# EAGLE design NeopixelStickOnAStick (EAGLE 7.4.0)
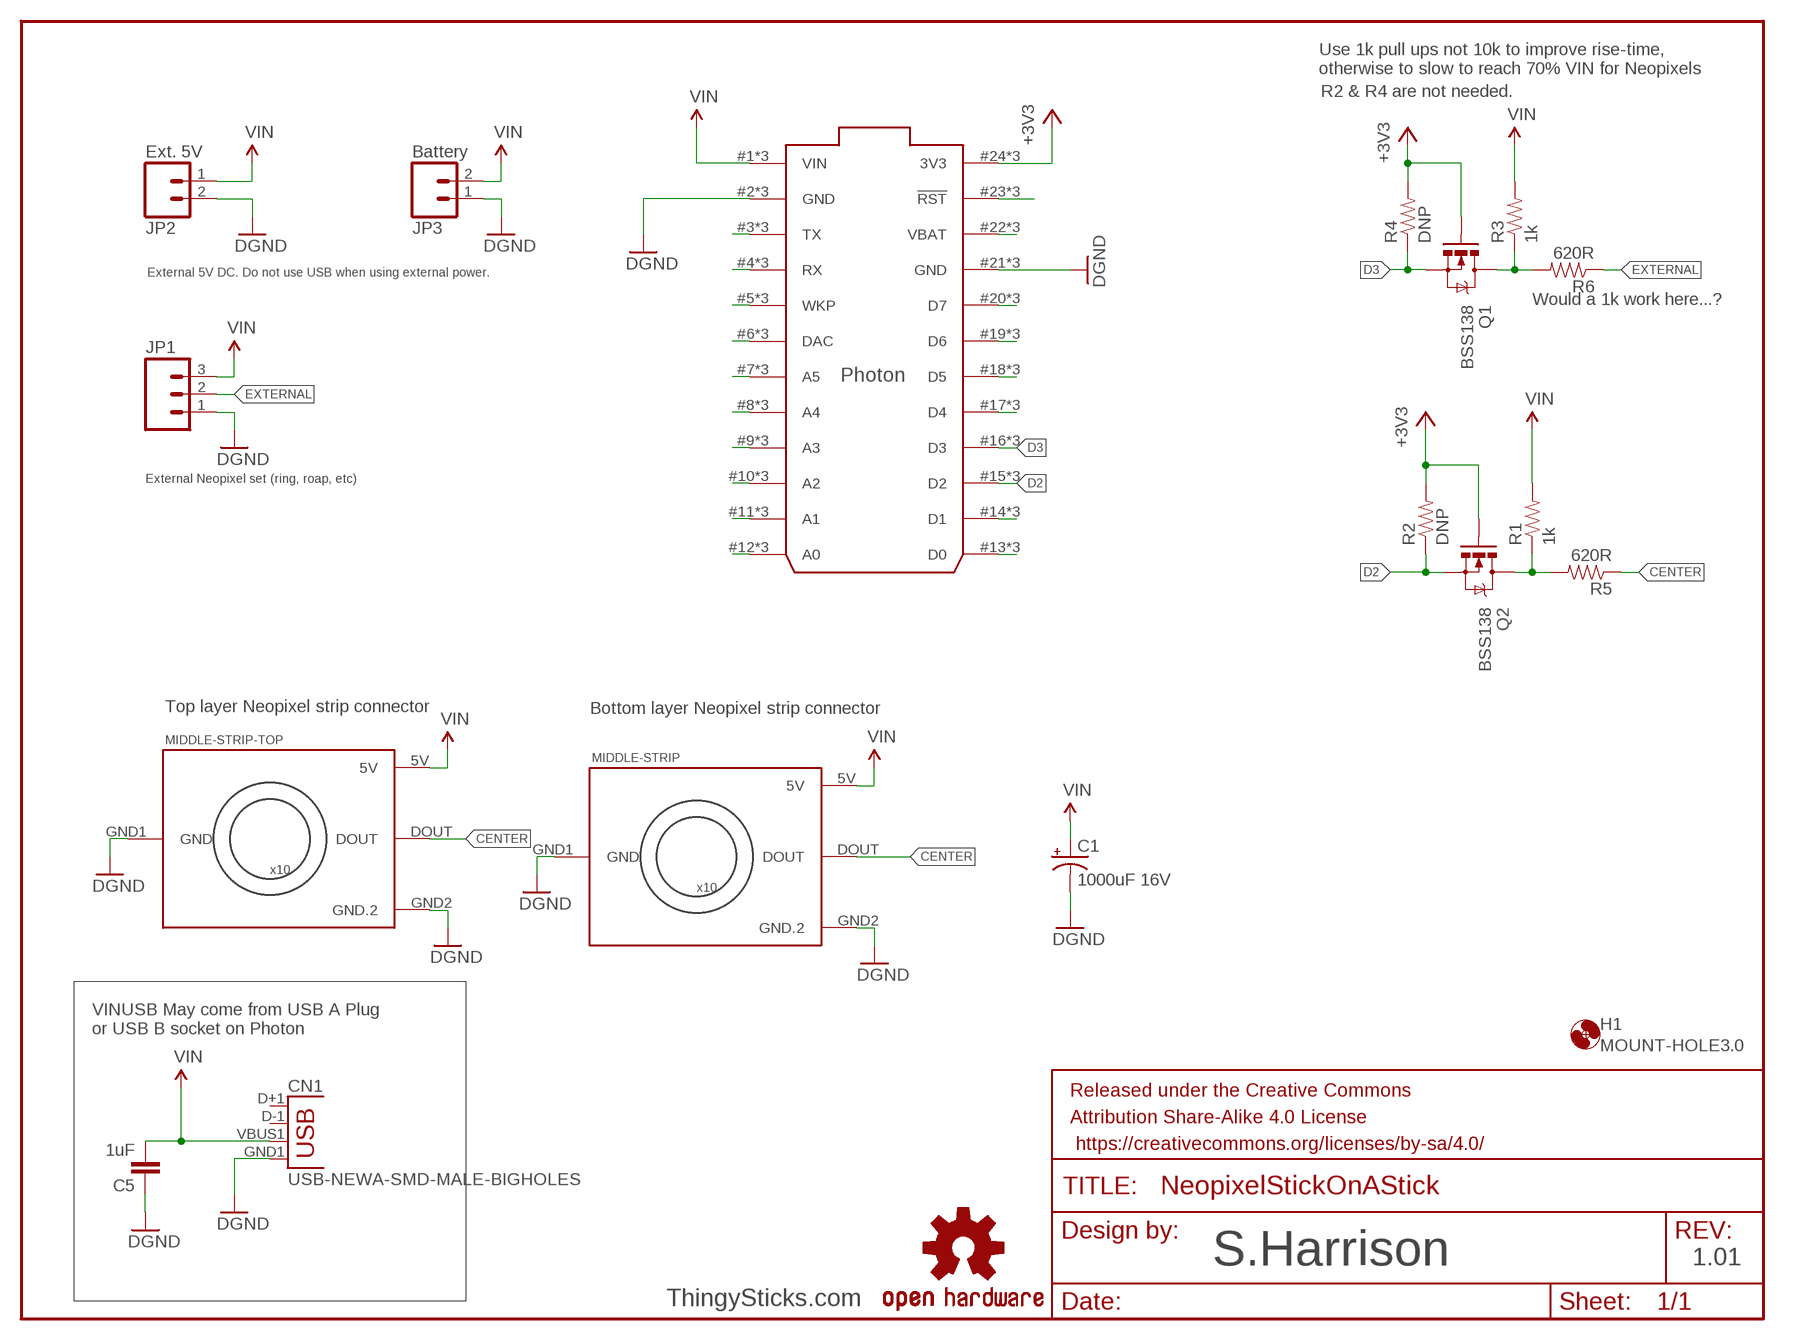
[diagram p0: schematic, sheet 1]

## Parts
C1  1000uF 16V  1000UF-25V(PTH)  [CPOL-RADIAL-1000UF-25V]
C5  1uF  CAP0805  [0805]
CN1  USB-NEWA-SMD-MALE-BIGHOLES  [USB-A-SMT-MALE]
FRAME2  FRAME-LETTER  [CREATIVE_COMMONS]
H1  MOUNT-HOLE3.0  [3,0]
JP1  M03POLAR  [MOLEX-1X3]
JP2  Ext. 5V  M023.5MM  [SCREWTERMINAL-3.5MM-2]
JP3  Battery  M02-JST-2MM-SMT  [JST-2-SMD]
LOGO2  OSHW-LOGOM  [OSHW-LOGO-M]
MIDDLE-STRIP  NEOPIXEL-STRIPBOTTOM'  [NEOPIXEL-STRIP]
MIDDLE-STRIP-TOP  NEOPIXEL-STRIPBOTTOM'  [NEOPIXEL-STRIP]
Q1  BSS138  MOSFET-NCHANNELBSS138  [SOT23-3]
Q2  BSS138  MOSFET-NCHANNELBSS138  [SOT23-3]
R1  1k  RESISTOR1206  [1206]
R2  DNP  RESISTOR1206  [1206]
R3  1k  RESISTOR1206  [1206]
R4  DNP  RESISTOR1206  [1206]
R5  620R  RESISTOR1206  [1206]
R6  620R  RESISTOR1206  [1206]
U$1  PHOTON_WITH_STACKABLE_HEADERS  [PHOTON_STACKABLE]

## Nets
+3V3: Q1.1(G) Q2.1(G) R2.2 R4.2 U$1.24(3V3) U$1.#24(3V3) U$1.@24(3V3)
CENTER: MIDDLE-STRIP-TOP.DOUT MIDDLE-STRIP.DOUT R5.1
D2: Q2.2(S) R2.1 U$1.15(D2) U$1.#15(D2) U$1.@15(D2)
D3: Q1.2(S) R4.1 U$1.16(D3) U$1.#16(D3) U$1.@16(D3)
EXTERNAL: JP1.2 R6.1
GND: C1.- C5.1 CN1.GND1(GND) JP1.1 JP2.2 JP3.1 MIDDLE-STRIP-TOP.GND1(GND) MIDDLE-STRIP-TOP.GND2(GND.2) MIDDLE-STRIP.GND1(GND) MIDDLE-STRIP.GND2(GND.2) U$1.2(GND) U$1.21(GND) U$1.#2(GND) U$1.#21(GND) U$1.@2(GND) U$1.@21(GND) ; supply symbol labelled DGND
N$1: U$1.13(D0) U$1.#13(D0) U$1.@13(D0)
N$3: U$1.14(D1) U$1.#14(D1) U$1.@14(D1)
N$4: Q1.3(D) R3.1 R6.2
N$5: Q2.3(D) R1.1 R5.2
N$6: U$1.17(D4) U$1.#17(D4) U$1.@17(D4)
N$7: U$1.18(D5) U$1.#18(D5) U$1.@18(D5)
N$11: U$1.19(D6) U$1.#19(D6) U$1.@19(D6)
N$12: U$1.20(D7) U$1.#20(D7) U$1.@20(D7)
N$13: U$1.22(VBAT) U$1.#22(VBAT) U$1.@22(VBAT)
N$14: U$1.23(!RST) U$1.#23(!RST) U$1.@23(!RST)
N$16: U$1.3(TX) U$1.#3(TX) U$1.@3(TX)
N$18: U$1.4(RX) U$1.#4(RX) U$1.@4(RX)
N$19: U$1.5(WKP) U$1.#5(WKP) U$1.@5(WKP)
N$20: U$1.6(DAC) U$1.#6(DAC) U$1.@6(DAC)
N$21: U$1.7(A5) U$1.#7(A5) U$1.@7(A5)
N$22: U$1.8(A4) U$1.#8(A4) U$1.@8(A4)
N$23: U$1.9(A3) U$1.#9(A3) U$1.@9(A3)
N$24: U$1.10(A2) U$1.#10(A2) U$1.@10(A2)
N$25: U$1.11(A1) U$1.#11(A1) U$1.@11(A1)
N$26: U$1.12(A0) U$1.#12(A0) U$1.@12(A0)
VIN: C1.+ C5.2 CN1.VBUS1(VBUS) JP1.3 JP2.1 JP3.2 MIDDLE-STRIP-TOP.5V MIDDLE-STRIP.5V R1.2 R3.2 U$1.1(VIN) U$1.#1(VIN) U$1.@1(VIN)
Unconnected: CN1.D+1(D+) CN1.D-1(D-)

## Notes on the sheet
- Use 1k pull ups not 10k to improve rise-time, 
  otherwise to slow to reach 70% VIN for Neopixels
- R2 & R4 are not needed.
- External 5V DC. Do not use USB when using external power.
- Would a 1k work here...?
- External Neopixel set (ring, roap, etc)
- Top layer Neopixel strip connector | Bottom layer Neopixel strip connector
- VINUSB May come from USB A Plug 
  or USB B socket on Photon
- S.Harrison | 1.01
- ThingySticks.com

## Library data of the parts
C1 = SparkFun-Capacitors:1000UF-25V(PTH): CAP-08070; PROD_ID: CAP-09538; VALUE: CAP-09538
C5 = SparkFun-Passives:CAP: Capacitor Standard 0603 ceramic capacitor, and 0.1" leaded capacitor.
CN1 = Tinamous:USB-NEW: USB Connectors USB-B-PTH is fully proven SKU : PRT-00139/CONN-08278 USB-miniB is fully proven SKU : PRT-00587 USB-A-PCB is untested. USB-A-H is throughly reviewed, but untested. Spark Fun Electronics SKU : PRT-00437 USB-B-SMT is throughly reviewed, but untested. Needs silkscreen touching up. USB-A-S has not been used/tested USB-MB-H has not been used/tested USB-MICROB has been used. CONN-09505
FRAME2 = SparkFun-Aesthetics:FRAME-LETTER: Schematic Frame Standard 8.5x11 US Letter frame
H1 = holes:MOUNT-HOLE: MOUNTING HOLE with drill center marker
JP1 = SparkFun-Connectors:M03: Header 3 Standard 3-pin 0.1" header. Use with straight break away headers (SKU : PRT-00116), right angle break away headers (PRT-00553), swiss pins (PRT-00743), machine pins (PRT-00117), and female headers (PRT-00115). Molex polarized connector foot print use with SKU : PRT-08232 with associated crimp pins and housings.
JP2 = SparkFun-Connectors:M02: Standard 2-pin 0.1" header. Use with - straight break away headers ( PRT-00116) - right angle break away headers (PRT-00553) - swiss pins (PRT-00743) - machine pins (PRT-00117) - female headers (PRT-00115) Molex polarized connector foot print use with: PRT-08233 with associated crimp pins and housings. 2.54_SCREWTERM for use with PRT-10571. 3.5mm Screw Terminal footprints for PRT-08084 5mm Screw Terminal footprints for use with PRT-08432; PROD_ID: CONN-08399
JP3 = SparkFun-Connectors:M02: Standard 2-pin 0.1" header. Use with - straight break away headers ( PRT-00116) - right angle break away headers (PRT-00553) - swiss pins (PRT-00743) - machine pins (PRT-00117) - female headers (PRT-00115) Molex polarized connector foot print use with: PRT-08233 with associated crimp pins and housings. 2.54_SCREWTERM for use with PRT-10571. 3.5mm Screw Terminal footprints for PRT-08084 5mm Screw Terminal footprints for use with PRT-08432; PROD_ID: CONN-11443
LOGO2 = SparkFun-Aesthetics:OSHW-LOGO: Open Source Hardware Logo This logo indicates the piece of hardware it is found on incorporates a OSHW license and/or adheres to the definition of open source hardware found here: http://freedomdefined.org/OSHW
MIDDLE-STRIP MIDDLE-STRIP-TOP = Tinamous:NEOPIXEL-STRIP
Q1 Q2 = SparkFun-DiscreteSemi:MOSFET-NCHANNEL: Common NMOSFET Parts MFG P/N Store ID Prod ID FDD8780 TRANS-09984 SI7820DN TRANS-11055 FDS6630A IC-08089 2N7002PW TRANS-11151 FQP30N06L COM-10213 TRANS-10060 BSS123LT1G TRANS-08345 BSS138 TRANS-00830 BS170 2N7000; PROD_ID: TRANS-00830; VALUE: 200mA/50V
R1-R6 = SparkFun-Resistors:RESISTOR: Resistor Basic schematic elements and footprints for 0603, 1206, and PTH resistors.
U$1 = Tinamous:PHOTON

## Board
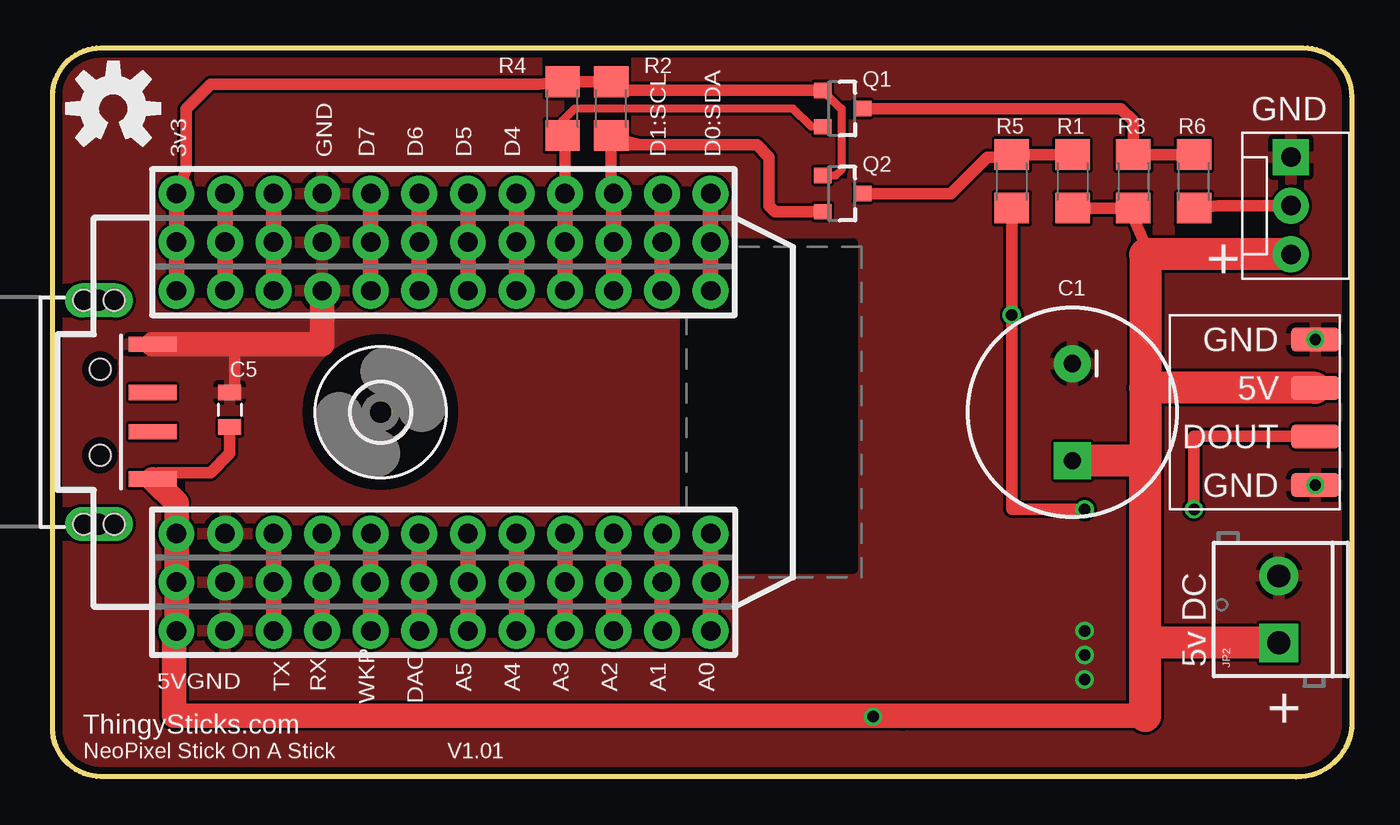
[diagram p1: board, top side]
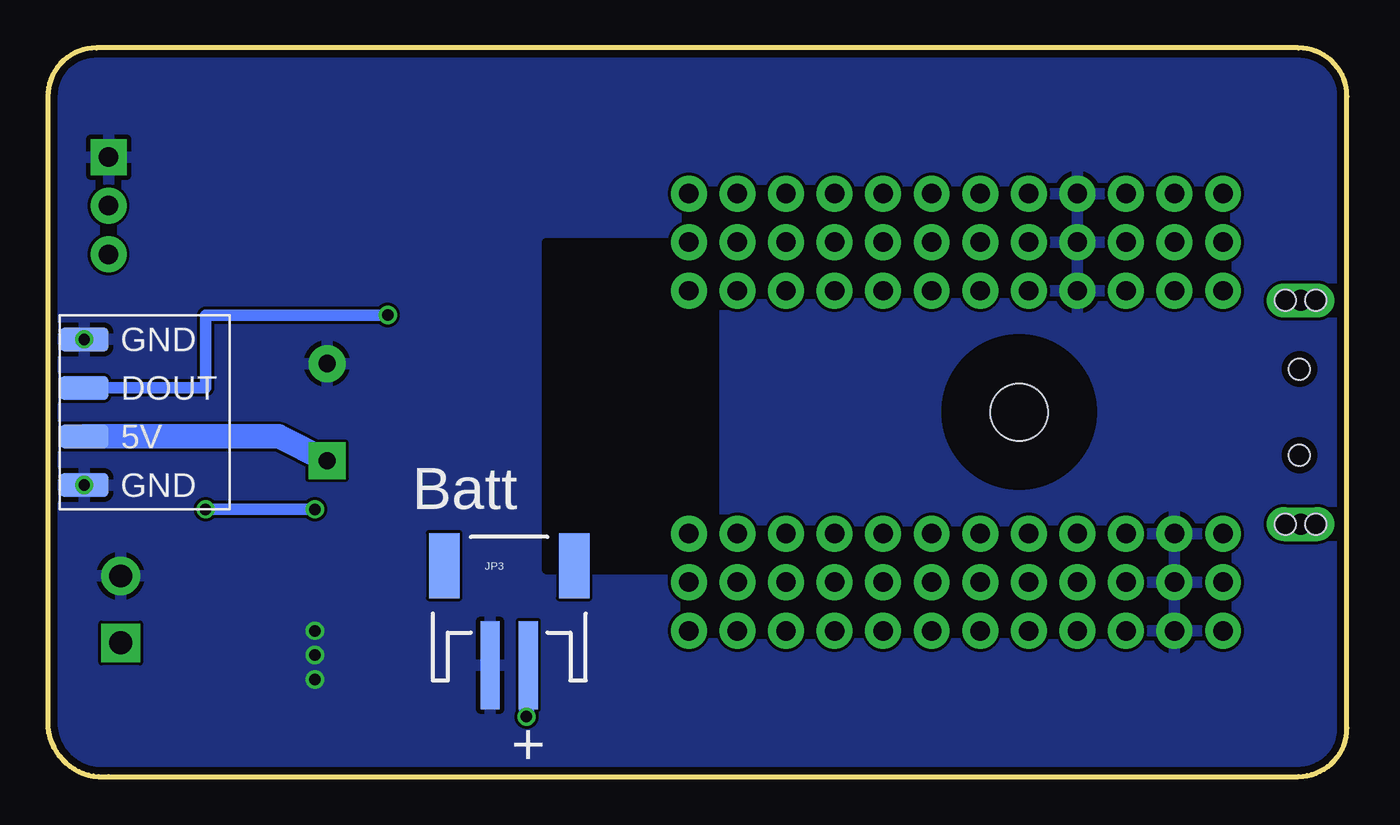
[diagram p2: board, bottom side, seen from below]

Size 67.94 x 38.12 mm. Coordinates in mm from the lower left corner, seen from the top.
Outline: 0,2.56 0,35.58 arc-90 2.54,38.12 65.41,38.12 arc-90 67.94,35.58 67.94,2.56 arc-90 64.77,0.02 2.54,0.02 arc-90 0,2.56
Copper layers (1*16): Top 0.0356mm / dielectric 1.5011mm / Bottom 0.0356mm
Design rules "OSHPark": minimum track width 6mil, minimum drill 13mil, track to track 6mil, track to pad 6mil, pad to pad 6mil, via to via 6mil, smd to smd 6mil, copper to edge 15mil, drill to drill 6mil, minimum pad ring 7mil, minimum via ring 7mil, stop-mask expansion 3mil, vias tented up to drill 0mil, thermal gap 10mil
tRestrict: area 33,10.8 to 41.9,28
bRestrict: area 33,10.8 to 41.9,28

### Footprints (pad centres in the part's own frame; a part is rotated, then mirrored left to right if it is on the bottom)
CPOL-RADIAL-1000UF-25V = drill 0.9 pad 1.93 square: + 2.54,0 | drill 0.9 pad 1.93: - -2.54,0
0805 = smd 0.8 x 1.2: 1 -0.9,0; 2 0.9,0
USB-A-SMT-MALE = smd 0.8 x 2.5: D+1 1.027,-5.87; D-1 -1.027,-5.87; GND1 3.551,-5.87; VBUS1 -3.5,-5.87 | drill 1.1 pad 1.778 long: P$1 5.85,-3.05; P$3 -5.85,-3.05 | hole 1.1: 2.25,-3.12; -2.25,-3.12; -5.85,-3.85; -5.85,-2.25; 5.85,-3.85; 5.85,-2.25
3,0 = hole 3: 0,0
MOLEX-1X3 = drill 1.016 pad 1.88 square: 1 0,0 | drill 1.016 pad 1.88: 2 2.54,0; 3 5.08,0
SCREWTERMINAL-3.5MM-2 = drill 1.2 pad 2.032 square: 1 0,0 | drill 1.2 pad 2.032: 2 3.5,0
JST-2-SMD = smd 1 x 4.6: 1 -1,-3.7; 2 1,-3.7 | smd 1.6 x 3.4: NC1 -3.4,1.5; NC2 3.4,1.5
NEOPIXEL-STRIP = smd 1.27 x 2.54 bottom: 5V 6.35,-1.27; DOUT 3.81,-1.27; GND1 8.89,-1.27; GND2 1.27,-1.27
SOT23-3 = smd 0.8 x 0.9: 1 -0.95,-1; 2 0.95,-1; 3 0,1.1
1206 = smd 1.6 x 1.8: 1 -1.4,0; 2 1.4,0
PHOTON_STACKABLE = drill 1.016 pad 1.88: 1 1.27,32.258; 2 1.27,29.718; 3 1.27,27.178; 4 1.27,24.638; 5 1.27,22.098; 6 1.27,19.558; 7 1.27,17.018; 8 1.27,14.478; 9 1.27,11.938; 10 1.27,9.398; 11 1.27,6.858; 12 1.27,4.318; 13 19.05,4.318; 14 19.05,6.858; 15 19.05,9.398; 16 19.05,11.938; 17 19.05,14.478; 18 19.05,17.018; 19 19.05,19.558; 20 19.05,22.098; 21 19.05,24.638; 22 19.05,27.178; 23 19.05,29.718; 24 19.05,32.258; #1 3.81,32.258; #2 3.81,29.718; #3 3.81,27.178; #4 3.81,24.638; #5 3.81,22.098; #6 3.81,19.558; #7 3.81,17.018; #8 3.81,14.478; #9 3.81,11.938; #10 3.81,9.398; #11 3.81,6.858; #12 3.81,4.318; #13 21.59,4.318; #14 21.59,6.858; #15 21.59,9.398; #16 21.59,11.938; #17 21.59,14.478; #18 21.59,17.018; #19 21.59,19.558; #20 21.59,22.098; #21 21.59,24.638; #22 21.59,27.178; #23 21.59,29.718; #24 21.59,32.258; @1 -1.27,32.258; @2 -1.27,29.718; @3 -1.27,27.178; @4 -1.27,24.638; @5 -1.27,22.098; @6 -1.27,19.558; @7 -1.27,17.018; @8 -1.27,14.478; @9 -1.27,11.938; @10 -1.27,9.398; @11 -1.27,6.858; @12 -1.27,4.318; @13 16.51,4.318; @14 16.51,6.858; @15 16.51,9.398; @16 16.51,11.938; @17 16.51,14.478; @18 16.51,17.018; @19 16.51,19.558; @20 16.51,22.098; @21 16.51,24.638; @22 16.51,27.178; @23 16.51,29.718; @24 16.51,32.258

### Placement (x,y rotation side)
C1  53.34,19.07 270 top
C5  9.27,19.19 270 top
CN1  -0.64,19.07 90 top
FRAME2  7.62,-8.87 0 top  (outside the outline)
H1  17.14,19.07 0 top
JP1  64.77,32.4 270 top
JP2  64.13,7 90 top
JP3  43.82,9.54 0 bottom
LOGO2  3.17,34.94 0 top
MIDDLE-STRIP  67.31,24.15 270 top
MIDDLE-STRIP-TOP  67.31,13.99 90 bottom
Q1  41.27,34.94 270 top
Q2  41.27,30.5 270 top
R1  53.34,31.13 270 top
R2  29.21,34.94 90 top
R3  56.52,31.13 270 top
R4  26.67,34.94 90 top
R5  50.16,31.13 90 top
R6  59.69,31.13 90 top
U$1  38.73,8.91 90 top

### Tracks (layer width: path | path; a pad name or v marks a point on that pad's centre or on a via)
+3V3
  Top 0.406: 29.02,35.89 R2.2 | Q2.1 40.96,31.45 41.27,31.77 41.27,34.94 41.23,34.94 Q1.1
  Top 0.61: Q1.1 29.02,35.89 | R2.2 R4.2 25.4,36.21 8.26,36.21 6.99,34.94 6.99,31.77 U$1.#24 6.99,31.01
  Top 0.813: U$1.#24 U$1.24 U$1.@24
CENTER  (via drill 0.6)
  Top 0.61: R5.1 v50.16,24.15 50.16,13.99 v53.98,13.99 | v59.69,13.99 59.69,17.8 MIDDLE-STRIP-TOP.DOUT
  Bottom 0.61: v53.98,13.99 v59.69,13.99 | v50.16,24.15 59.69,24.15 59.69,20.34 MIDDLE-STRIP.DOUT
D2
  Top 0.406: 29.21,30.62 U$1.#15 | R2.1 31.11,33.04
  Top 0.61: Q2.2 37.78,29.55 37.47,29.86 37.47,32.4 36.83,33.04 31.11,33.04 29.21,33.04 29.21,30.62
  Top 0.813: U$1.#15 U$1.15 U$1.@15
D3
  Top 0.406: 26.8,33.42 R4.1 26.67,34.31 27.3,34.94 38.73,34.94 39.69,33.99 Q1.2
  Top 0.61: U$1.#16 26.8,33.42
  Top 0.813: U$1.@16 U$1.16 U$1.#16
EXTERNAL
  Top 0.61: JP1.2 60.96,29.86 R6.1
GND  (via drill 0.6)
  Top 0.61: C5.1 9.53,20.09 9.53,22.62
  Top 1.27: CN1.GND1 9.53,22.62 14.1,22.62 U$1.@21
  other vias: 66.04,22.88 66.04,15.26 53.98,6.37 53.98,7.64 53.98,5.1
  pour Bottom: -0.64,39.39 67.94,39.39 67.94,-1.89 -0.64,-1.89
  pour Top: -1.91,39.39 69.85,39.39 69.85,-3.16 -1.91,-3.16
N$1
  Top 0.813: U$1.#13 U$1.13 U$1.@13
N$3
  Top 0.813: U$1.@14 U$1.14 U$1.#14
N$4
  Top 0.61: Q1.3 55.88,34.94 56.52,34.31 R3.1 R6.2
N$5
  Top 0.61: Q2.3 46.99,30.5 48.9,32.4 50.3,32.4 R5.2 R1.1
N$6
  Top 0.813: U$1.#17 U$1.17 U$1.@17
N$7
  Top 0.813: U$1.@18 U$1.18 U$1.#18
N$11
  Top 0.813: U$1.#19 U$1.19 U$1.@19
N$12
  Top 0.813: U$1.@20 U$1.20 U$1.#20
N$13
  Top 0.813: U$1.#22 U$1.22 U$1.@22
N$14
  Top 0.813: U$1.@23 U$1.23 U$1.#23
N$16
  Top 0.813: U$1.@3 U$1.3 U$1.#3
N$18
  Top 0.813: U$1.#4 U$1.4 U$1.@4
N$19
  Top 0.813: U$1.@5 U$1.5 U$1.#5
N$20
  Top 0.813: U$1.#6 U$1.6 U$1.@6
N$21
  Top 0.813: U$1.@7 U$1.7 U$1.#7
N$22
  Top 0.813: U$1.#8 U$1.8 U$1.@8
N$23
  Top 0.813: U$1.@9 U$1.9 U$1.#9
N$24
  Top 0.813: U$1.#10 U$1.10 U$1.@10
N$25
  Top 0.813: U$1.@11 U$1.11 U$1.#11
N$26
  Top 0.813: U$1.#12 U$1.12 U$1.@12
VIN  (via drill 0.6)
  Top 0.406: 57.15,27.32 57.28,26.56 57.02,26.56
  Top 0.61: C5.2 9.27,16.91 8.26,15.89 5.56,15.89 CN1.VBUS1 | 57.15,27.32 57.02,26.56 57.15,27.83 56.52,29.23 R3.2 R1.2
  Top 0.813: v42.91,3.14 44.45,3.19
  Top 1.27: 57.15,3.19 44.45,3.19 6.35,3.19 6.35,7.51 U$1.@1 U$1.1 U$1.#1 6.48,14.33 CN1.VBUS1
  Top 1.676: 57.15,3.19 57.15,7 | 57.15,16.53 v53.34,16.53 | JP1.3 57.15,27.32 57.15,20.34 | 57.15,20.34 57.15,16.53 | JP2.1 57.15,7 | 57.15,7 57.15,16.53 | MIDDLE-STRIP-TOP.5V 57.15,20.34
  Bottom 0.813: JP3.2 v42.91,3.14
  Bottom 1.27: v53.34,16.53 55.88,17.8 MIDDLE-STRIP.5V

### Text on the board
tNames: GND | 3v3 | GND | D7 | D6 | D5 | D4 | D1:SCL | D0:SDA | + | 5V | GND | 5v DC | TX | RX | A5 | A4 | A3 | A2 | A1 | A0 | WKP | DAC | ThingySticks.com | + | NeoPixel Stick On A Stick | V1.01
bNames: Batt | +